# EAGLE design 595shiftOut (EAGLE 7.3.0)
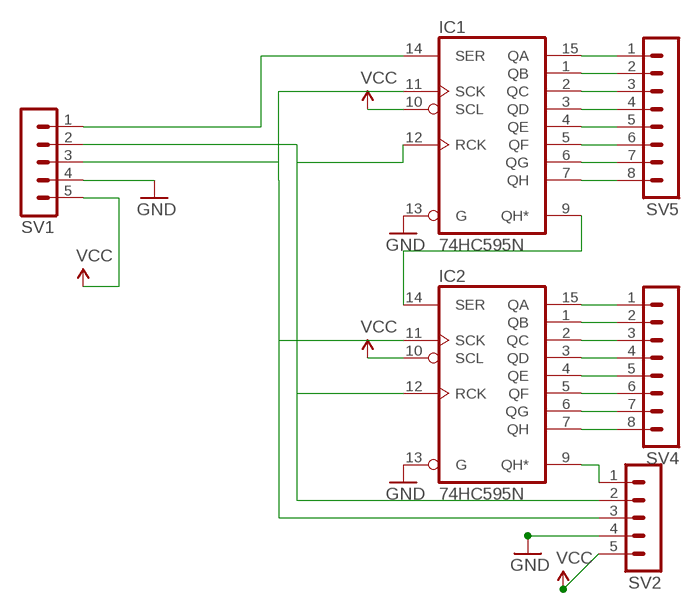
[diagram p0: schematic, sheet 1]

## Parts
IC1  74HC595N  [DIL16]
IC2  74HC595N  [DIL16]
SV1  MA05-1  [MA05-1]
SV2  MA05-1  [MA05-1]
SV4  MA08-1  [MA08-1]
SV5  MA08-1  [MA08-1]

## Nets
GND: IC1.13(G) IC2.13(G) SV1.4 SV2.4
N$3: IC1.14(SER) SV1.1
N$4: IC1.12(RCK) IC2.12(RCK) SV1.2 SV2.2
N$5: IC1.11(SCK) IC2.11(SCK) SV1.3 SV2.3
N$6: IC2.15(QA) SV4.1
N$7: IC2.1(QB) SV4.2
N$8: IC2.2(QC) SV4.3
N$9: IC2.3(QD) SV4.4
N$10: IC2.4(QE) SV4.5
N$11: IC2.5(QF) SV4.6
N$12: IC2.6(QG) SV4.7
N$13: IC2.7(QH) SV4.8
N$14: IC1.15(QA) SV5.1
N$15: IC1.1(QB) SV5.2
N$16: IC1.2(QC) SV5.3
N$17: IC1.3(QD) SV5.4
N$18: IC1.4(QE) SV5.5
N$19: IC1.5(QF) SV5.6
N$20: IC1.6(QG) SV5.7
N$21: IC1.7(QH) SV5.8
N$22: IC1.9(QH*) IC2.14(SER)
N$23: IC2.9(QH*) SV2.1
VCC: IC1.10(SCL) IC2.10(SCL) SV1.5 SV2.5

## Power pins joined to a net without a drawn wire
GND: IC1.8(GND) IC2.8(GND)
VCC: IC1.16(VCC) IC2.16(VCC)

## Library data of the parts
IC1 IC2 = 74xx-eu:74*595: 8-bit SHIFT REGISTER, output latch
SV1 SV2 = con-lstb:MA05-1: PIN HEADER; OC_FARNELL: unknown; OC_NEWARK: unknown
SV4 SV5 = con-lstb:MA08-1: PIN HEADER; OC_FARNELL: unknown; OC_NEWARK: unknown

## Board
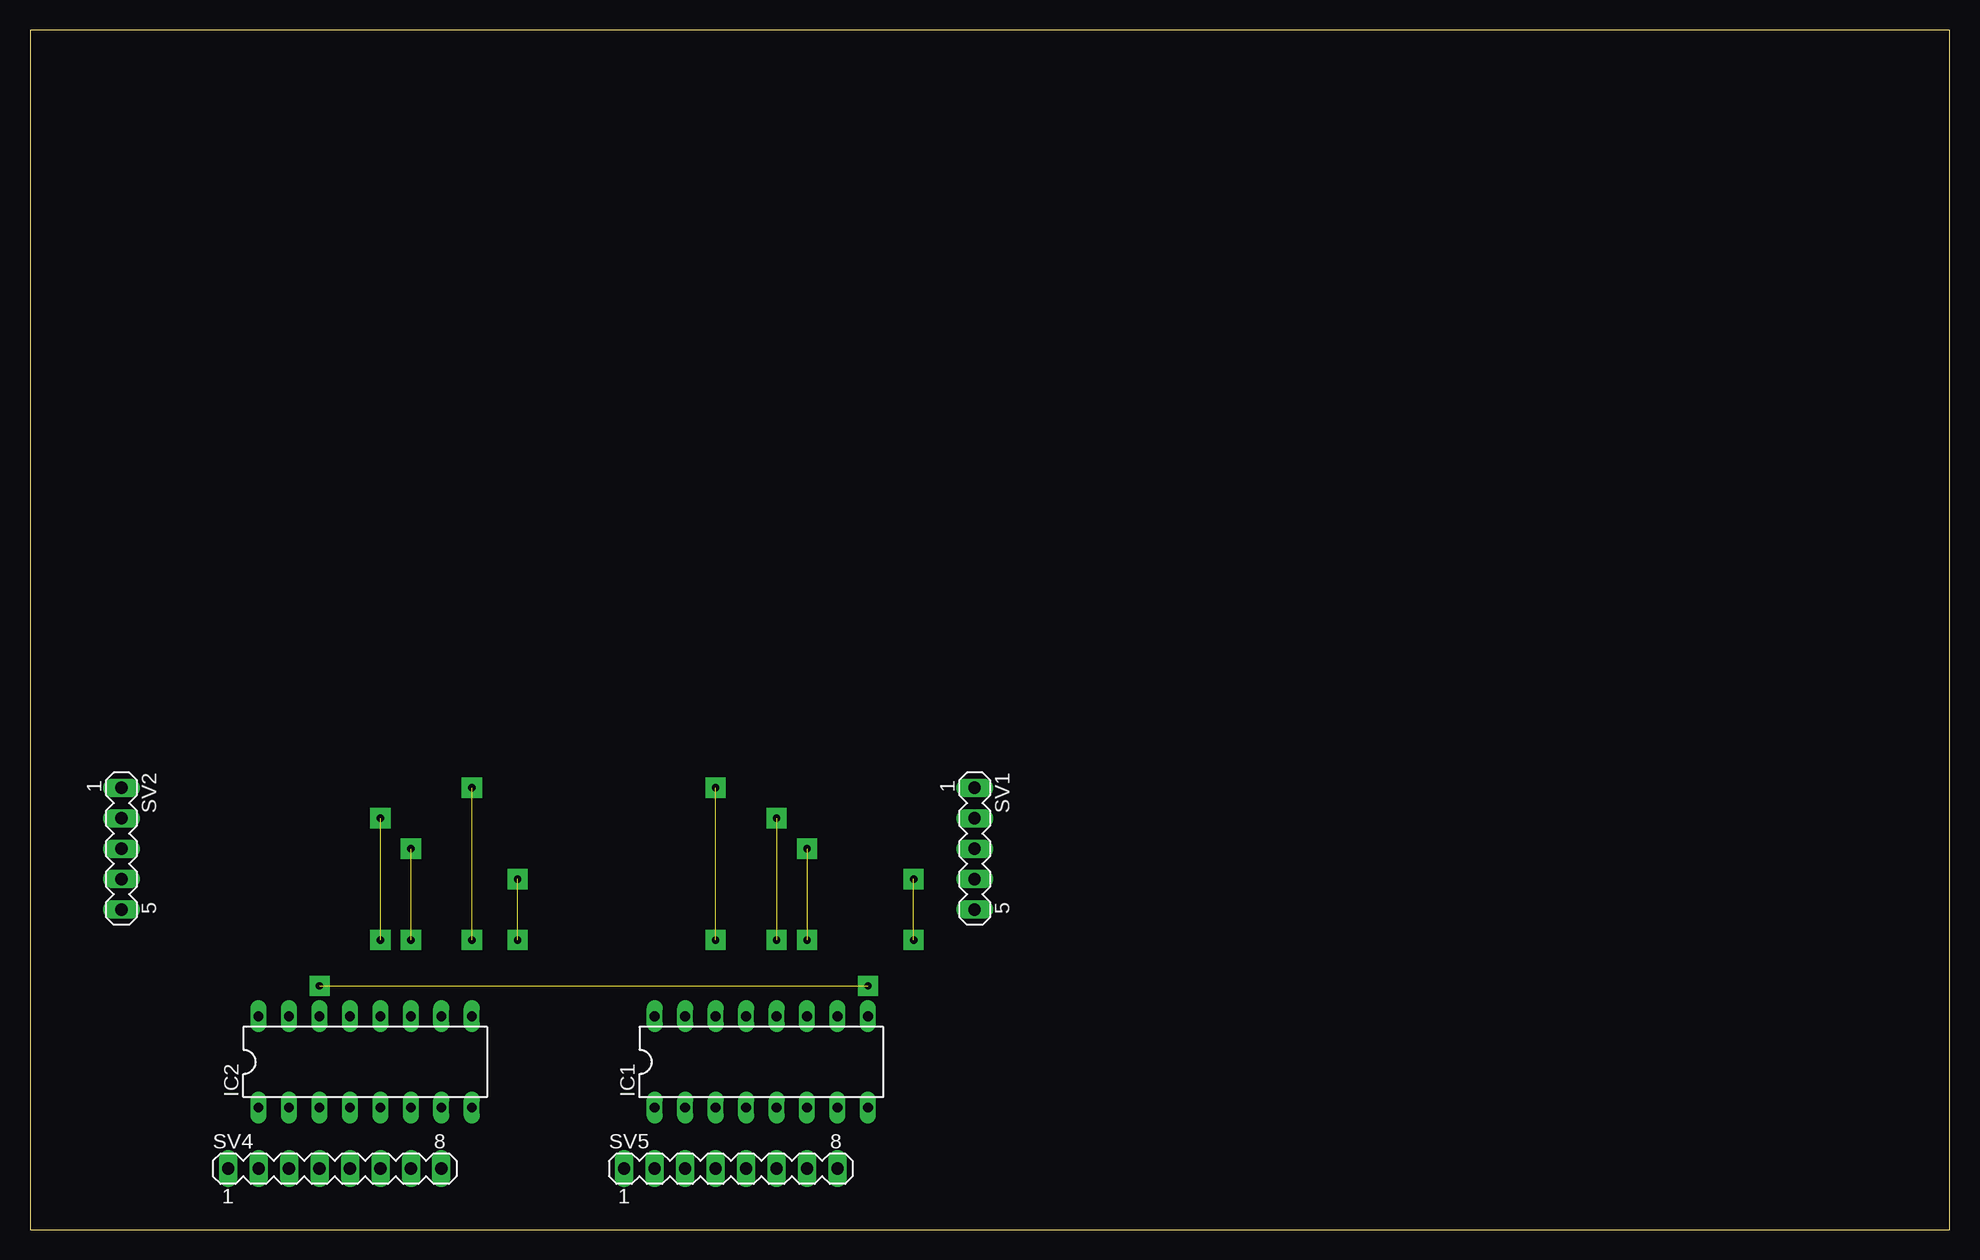
[diagram p1: board, top side]
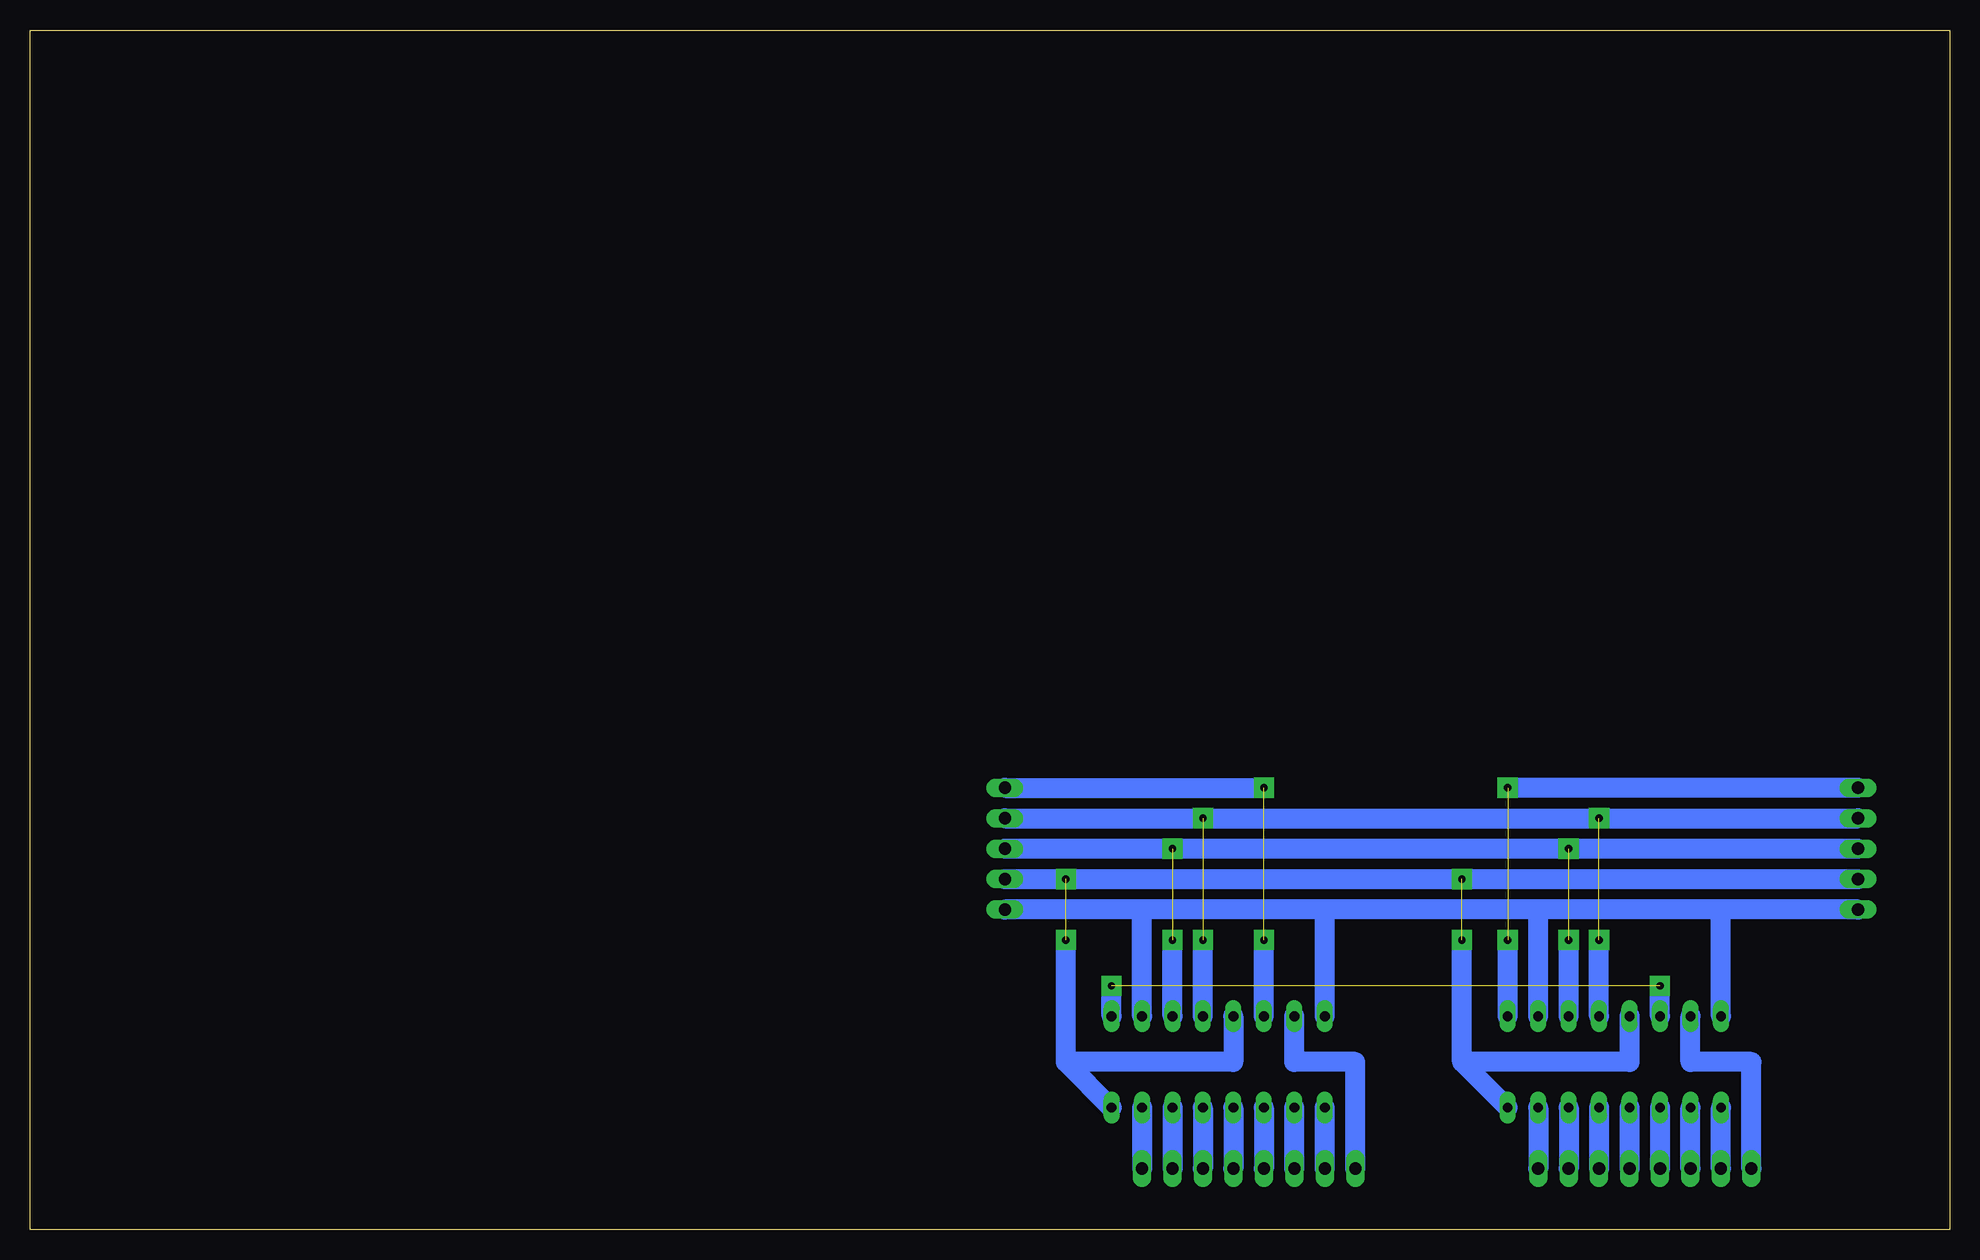
[diagram p2: board, bottom side, seen from below]

Size 160 x 100 mm. Coordinates in mm from the lower left corner, seen from the top.
Outline: 0,0 160,0 160,100 0,100 0,0
Copper layers (1*16): Top 0.035mm / dielectric 1.5mm / Bottom 0.035mm
Design rules "default": minimum track width 10mil, minimum drill 24mil, track to track 8mil, track to pad 8mil, pad to pad 8mil, via to via 8mil, smd to smd 8mil, copper to edge 40mil, drill to drill 8mil, minimum pad ring 10mil, minimum via ring 8mil, stop-mask expansion 4mil, vias tented up to drill 0mil, thermal gap 10mil

### Footprints (pad centres in the part's own frame; a part is rotated, then mirrored left to right if it is on the bottom)
DIL16 = drill 0.813 long: 1 -8.89,-3.81; 2 -6.35,-3.81; 3 -3.81,-3.81; 4 -1.27,-3.81; 5 1.27,-3.81; 6 3.81,-3.81; 7 6.35,-3.81; 8 8.89,-3.81; 9 8.89,3.81; 10 6.35,3.81; 11 3.81,3.81; 12 1.27,3.81; 13 -1.27,3.81; 14 -3.81,3.81; 15 -6.35,3.81; 16 -8.89,3.81
MA05-1 = drill 1.016 long: 1 -5.08,0; 2 -2.54,0; 3 0,0; 4 2.54,0; 5 5.08,0
MA08-1 = drill 1.016 long: 1 -8.89,0; 2 -6.35,0; 3 -3.81,0; 4 -1.27,0; 5 1.27,0; 6 3.81,0; 7 6.35,0; 8 8.89,0

### Placement (x,y rotation side)
IC1  60.96,13.97 0 top
IC2  27.94,13.97 0 top
SV1  78.74,31.75 270 top
SV2  7.62,31.75 270 top
SV4  25.4,5.08 0 top
SV5  58.42,5.08 0 top

### Tracks (layer width: path | path; a pad name or v marks a point on that pad's centre or on a via)
GND  (via drill 0.6 pad 1.68)  (2 unrouted)
  Bottom 1.676: SV1.4 v73.66,29.21 v40.64,29.21 SV2.4 | IC2.13 26.67,13.97 40.64,13.97 | IC2.8 40.64,13.97 | 40.64,13.97 v40.64,24.13 | IC1.13 59.69,13.97 73.66,13.97 | 73.66,13.97 IC1.8 | 73.66,13.97 73.66,24.13
N$1  (via drill 0.6 pad 1.68)
  other vias: 36.83,24.13
N$2  (via drill 0.6 pad 1.68)
  other vias: 57.15,24.13
N$3  (via drill 0.6 pad 1.68)  (1 unrouted)
  Bottom 1.676: SV1.1 v57.15,36.83 | IC1.14 57.15,24.13
N$4  (via drill 0.6 pad 1.68)  (2 unrouted)
  Bottom 1.676: SV1.2 v62.23,34.29 v29.21,34.29 SV2.2 | IC1.12 62.23,24.13 | IC2.12 29.21,24.13
N$5  (via drill 0.6 pad 1.68)  (2 unrouted)
  Bottom 1.676: SV2.3 v31.75,31.75 v64.77,31.75 SV1.3 | IC1.11 64.77,24.13 | IC2.11 31.75,24.13
N$6
  Bottom 1.676: SV4.1 16.51,13.97 21.59,13.97 IC2.15
N$7
  Bottom 1.676: SV4.2 IC2.1
N$8
  Bottom 1.676: SV4.3 IC2.2
N$9
  Bottom 1.676: IC2.3 SV4.4
N$10
  Bottom 1.676: IC2.4 SV4.5
N$11
  Bottom 1.676: IC2.5 SV4.6
N$12
  Bottom 1.676: IC2.6 SV4.7
N$13
  Bottom 1.676: IC2.7 SV4.8
N$14
  Bottom 1.676: SV5.1 49.53,13.97 54.61,13.97 IC1.15
N$15
  Bottom 1.676: SV5.2 IC1.1
N$16
  Bottom 1.676: SV5.3 IC1.2
N$17
  Bottom 1.676: IC1.3 SV5.4
N$18
  Bottom 1.676: IC1.4 SV5.5
N$19
  Bottom 1.676: IC1.5 SV5.6
N$20
  Bottom 1.676: IC1.6 SV5.7
N$21
  Bottom 1.676: IC1.7 SV5.8
N$22  (via drill 0.6 pad 1.68)  (1 unrouted)
  Bottom 1.676: IC1.9 v69.85,20.32 | IC2.14 v24.13,20.32
N$23  (via drill 0.6 pad 1.68)  (1 unrouted)
  Bottom 1.676: SV2.1 v36.83,36.83 | IC2.9 36.83,24.13
N$24  (via drill 0.6 pad 1.68)
  other vias: 31.75,24.13
N$25  (via drill 0.6 pad 1.68)
  other vias: 29.21,24.13
N$26  (via drill 0.6 pad 1.68)
  other vias: 62.23,24.13
N$27  (via drill 0.6 pad 1.68)
  other vias: 64.77,24.13
N$28  (via drill 0.6 pad 1.68)
  other vias: 73.66,24.13
VCC
  Bottom 1.676: SV2.5 19.05,26.67 | 19.05,26.67 34.29,26.67 | 34.29,26.67 52.07,26.67 | 52.07,26.67 67.31,26.67 | 67.31,26.67 SV1.5 | IC1.10 67.31,26.67 | IC2.16 19.05,26.67 | IC2.10 34.29,26.67 | IC1.16 52.07,26.67